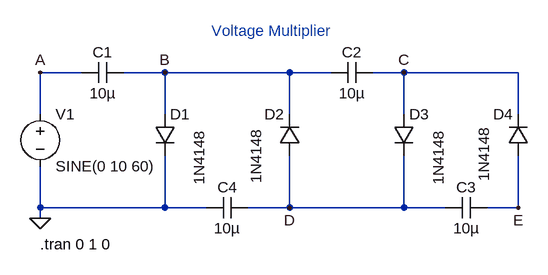
[diagram p0: schematic 3EEC_VELASCO_EXPT8_CKT1.asc]
3EEC_VELASCO_EXPT8_CKT1.asc, the LTspice schematic file:
Version 4
SHEET 1 880 680
WIRE 112 64 48 64
WIRE 240 64 176 64
WIRE 432 64 240 64
WIRE 496 64 432 64
WIRE 608 64 560 64
WIRE 784 64 608 64
WIRE 48 128 48 64
WIRE 240 128 240 64
WIRE 432 128 432 64
WIRE 608 128 608 64
WIRE 784 128 784 64
WIRE 48 272 48 208
WIRE 240 272 240 192
WIRE 240 272 48 272
WIRE 304 272 240 272
WIRE 432 272 432 192
WIRE 432 272 368 272
WIRE 608 272 608 192
WIRE 608 272 432 272
WIRE 672 272 608 272
WIRE 784 272 784 192
WIRE 784 272 736 272
WIRE 48 288 48 272
FLAG 48 64 A
FLAG 240 64 B
FLAG 608 64 C
FLAG 784 272 E
FLAG 432 272 D
FLAG 48 288 0
SYMBOL voltage 48 112 R0
SYMATTR InstName V1
SYMATTR Value SINE(0 10 60)
SYMBOL diode 224 128 R0
WINDOW 3 69 109 VLeft 2
SYMATTR InstName D1
SYMATTR Value 1N4148
SYMBOL cap 176 48 R90
WINDOW 0 0 32 VBottom 2
WINDOW 3 32 32 VTop 2
SYMATTR InstName C1
SYMATTR Value 10µ
SYMBOL diode 448 192 R180
WINDOW 0 24 64 Left 2
WINDOW 3 83 0 VBottom 2
SYMATTR InstName D2
SYMATTR Value 1N4148
SYMBOL diode 592 128 R0
WINDOW 3 69 109 VLeft 2
SYMATTR InstName D3
SYMATTR Value 1N4148
SYMBOL diode 800 192 R180
WINDOW 0 24 64 Left 2
WINDOW 3 69 45 VLeft 2
SYMATTR InstName D4
SYMATTR Value 1N4148
SYMBOL cap 560 48 R90
WINDOW 0 0 32 VBottom 2
WINDOW 3 32 32 VTop 2
SYMATTR InstName C2
SYMATTR Value 10µ
SYMBOL cap 736 256 R90
WINDOW 0 0 32 VBottom 2
WINDOW 3 32 32 VTop 2
SYMATTR InstName C3
SYMATTR Value 10µ
SYMBOL cap 368 256 R90
WINDOW 0 0 32 VBottom 2
WINDOW 3 32 32 VTop 2
SYMATTR InstName C4
SYMATTR Value 10µ
TEXT 48 328 Left 2 !.tran 0 1 0
TEXT 312 0 Left 2 ;Voltage Multiplier

The netlist it stands for:
* 3EEC_VELASCO_EXPT8_CKT1.asc
V1 A 0 SINE(0 10 60)
D1 B 0 1N4148
C1 B A 10µ
D2 D B 1N4148
D3 C D 1N4148
D4 E C 1N4148
C2 C B 10µ
C3 E D 10µ
C4 D 0 10µ
.model D D
.lib standard.dio
.tran 0 1 0
* Voltage Multiplier
.backanno
.end